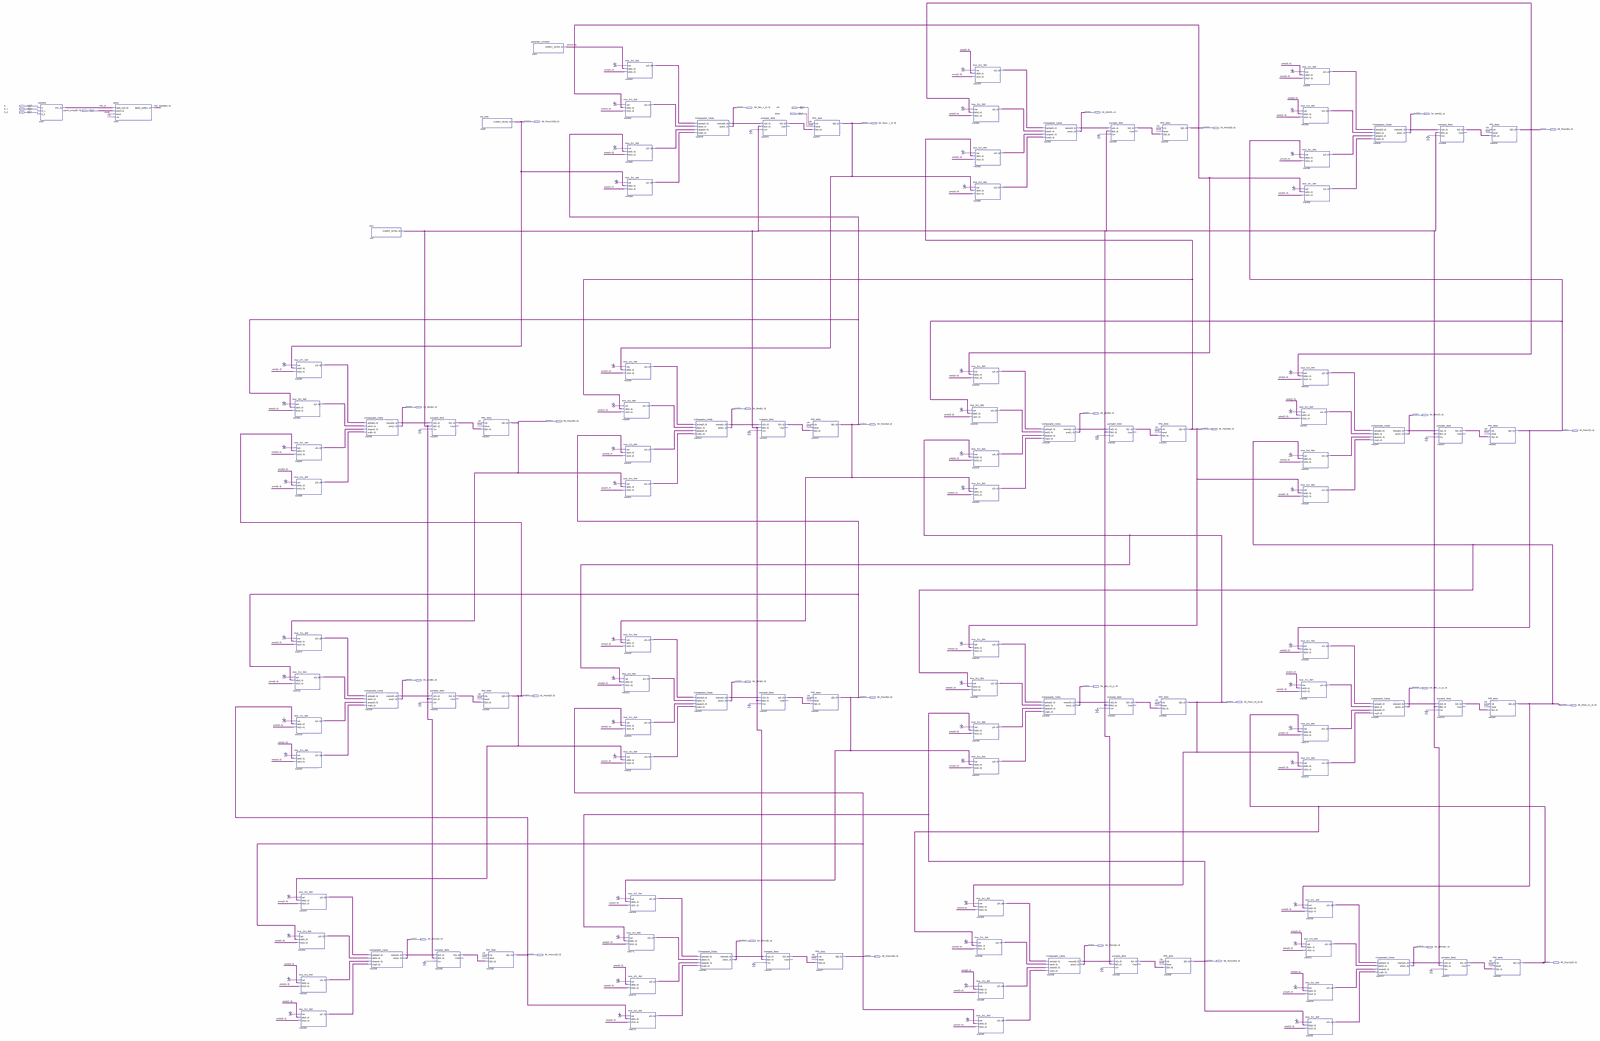
[diagram p0: schematic sheet, whole]
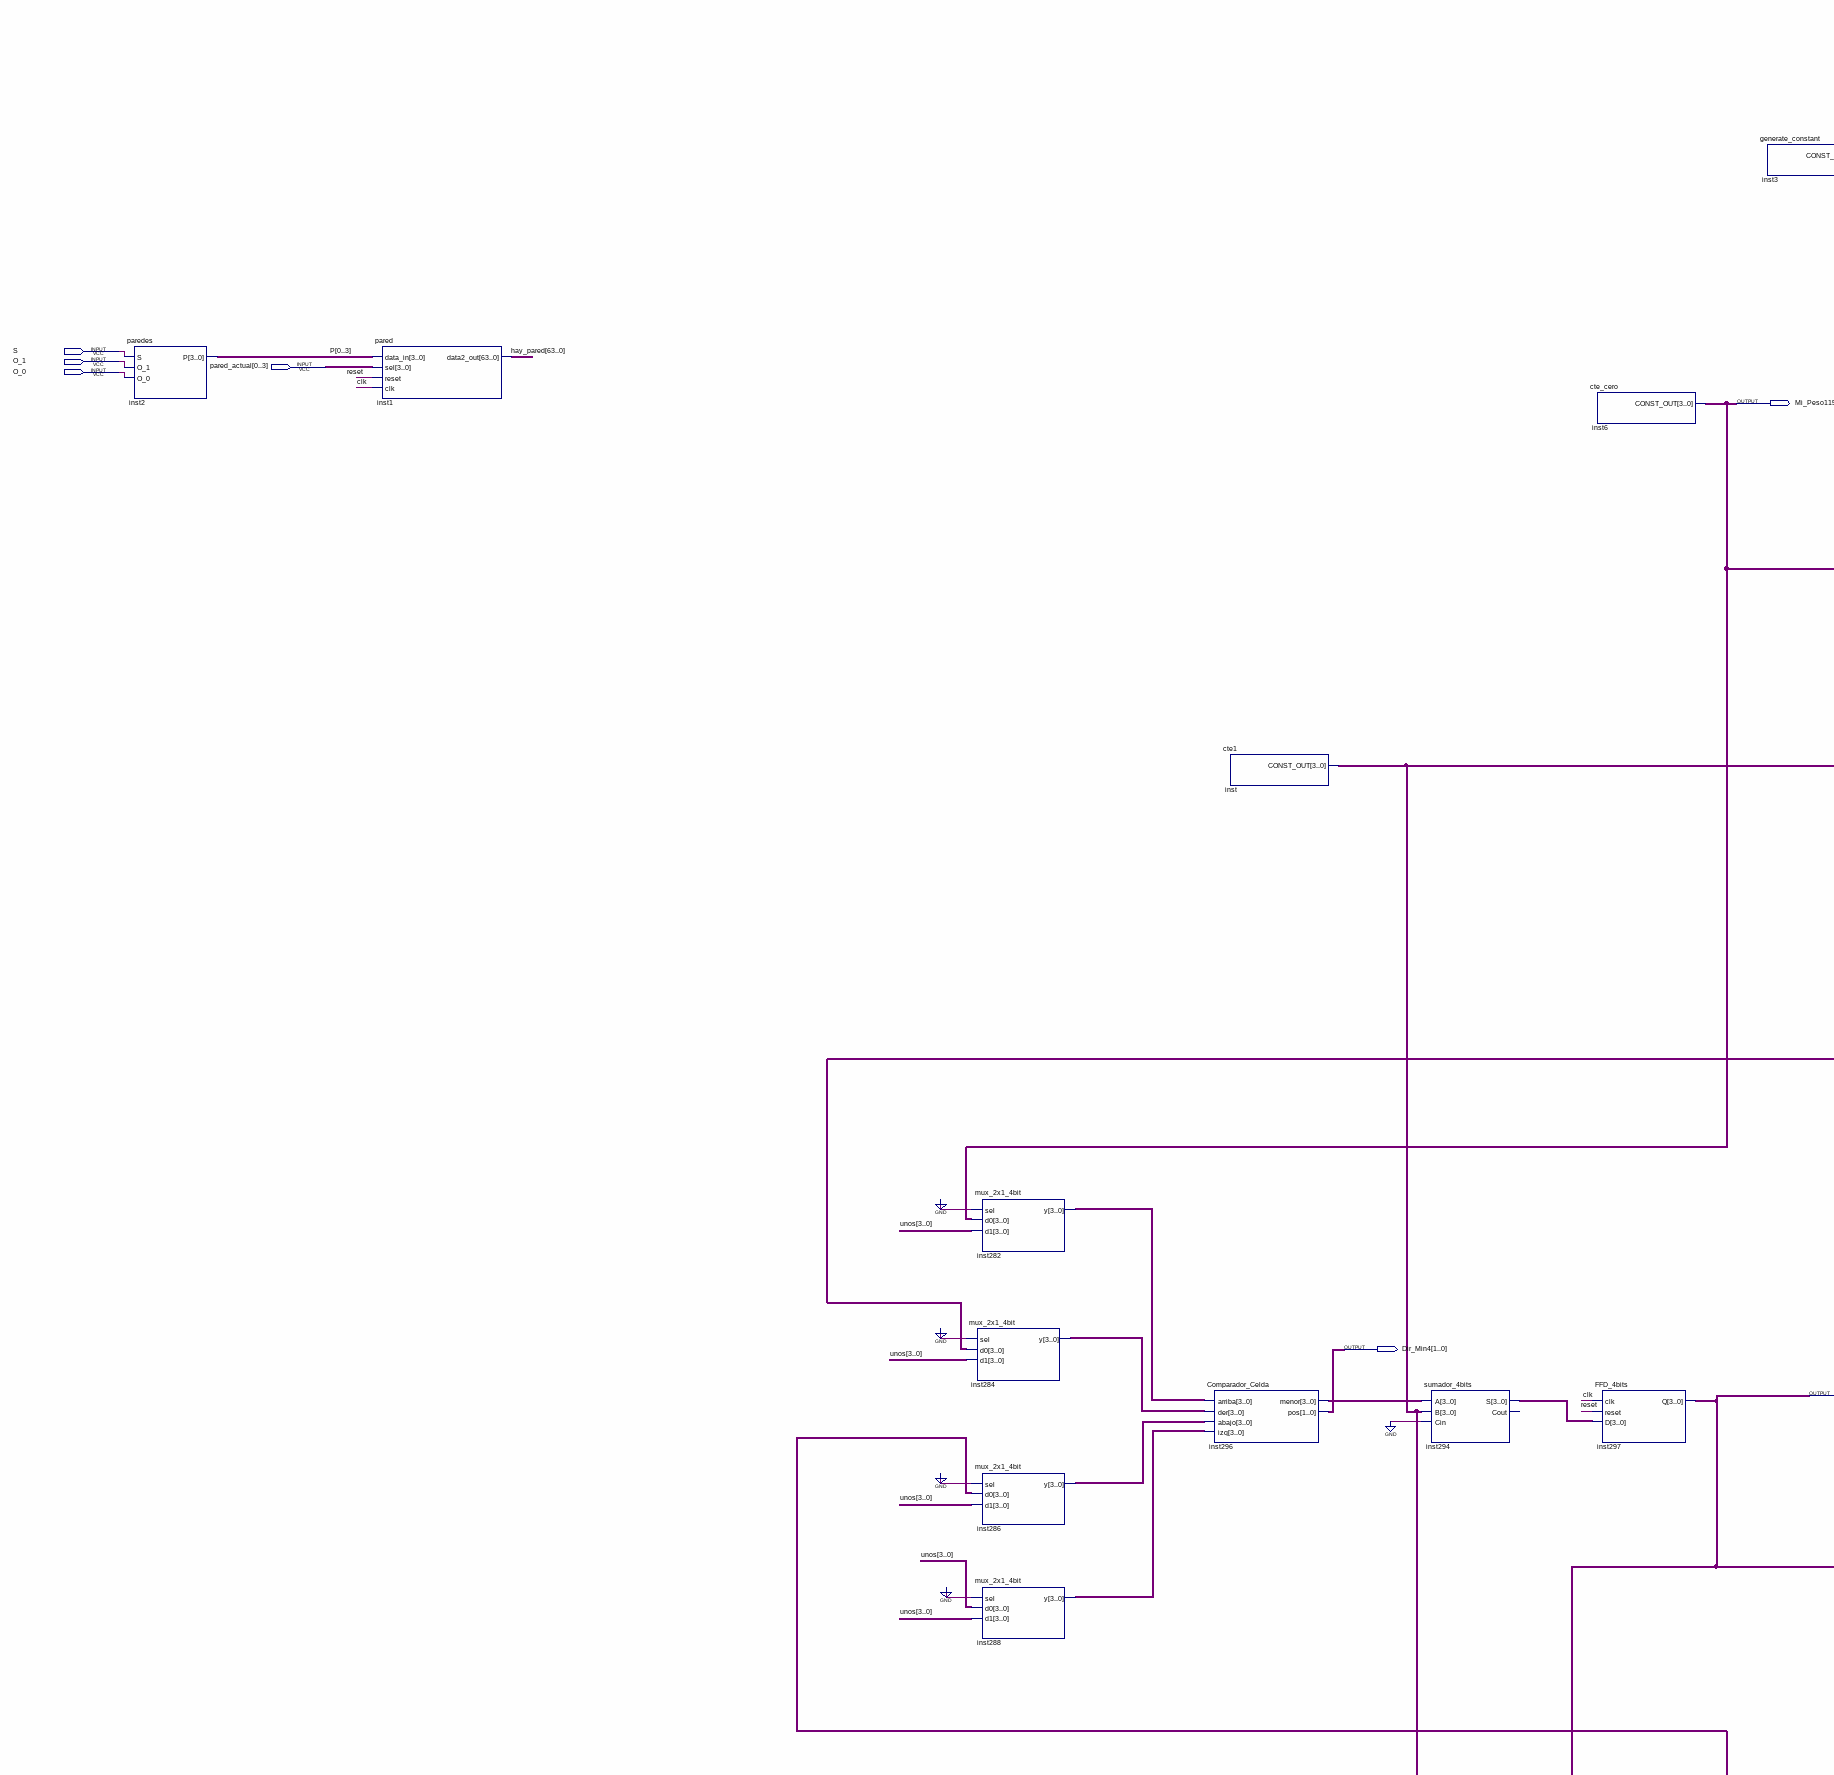
[diagram p1: schematic sheet, upper left part]
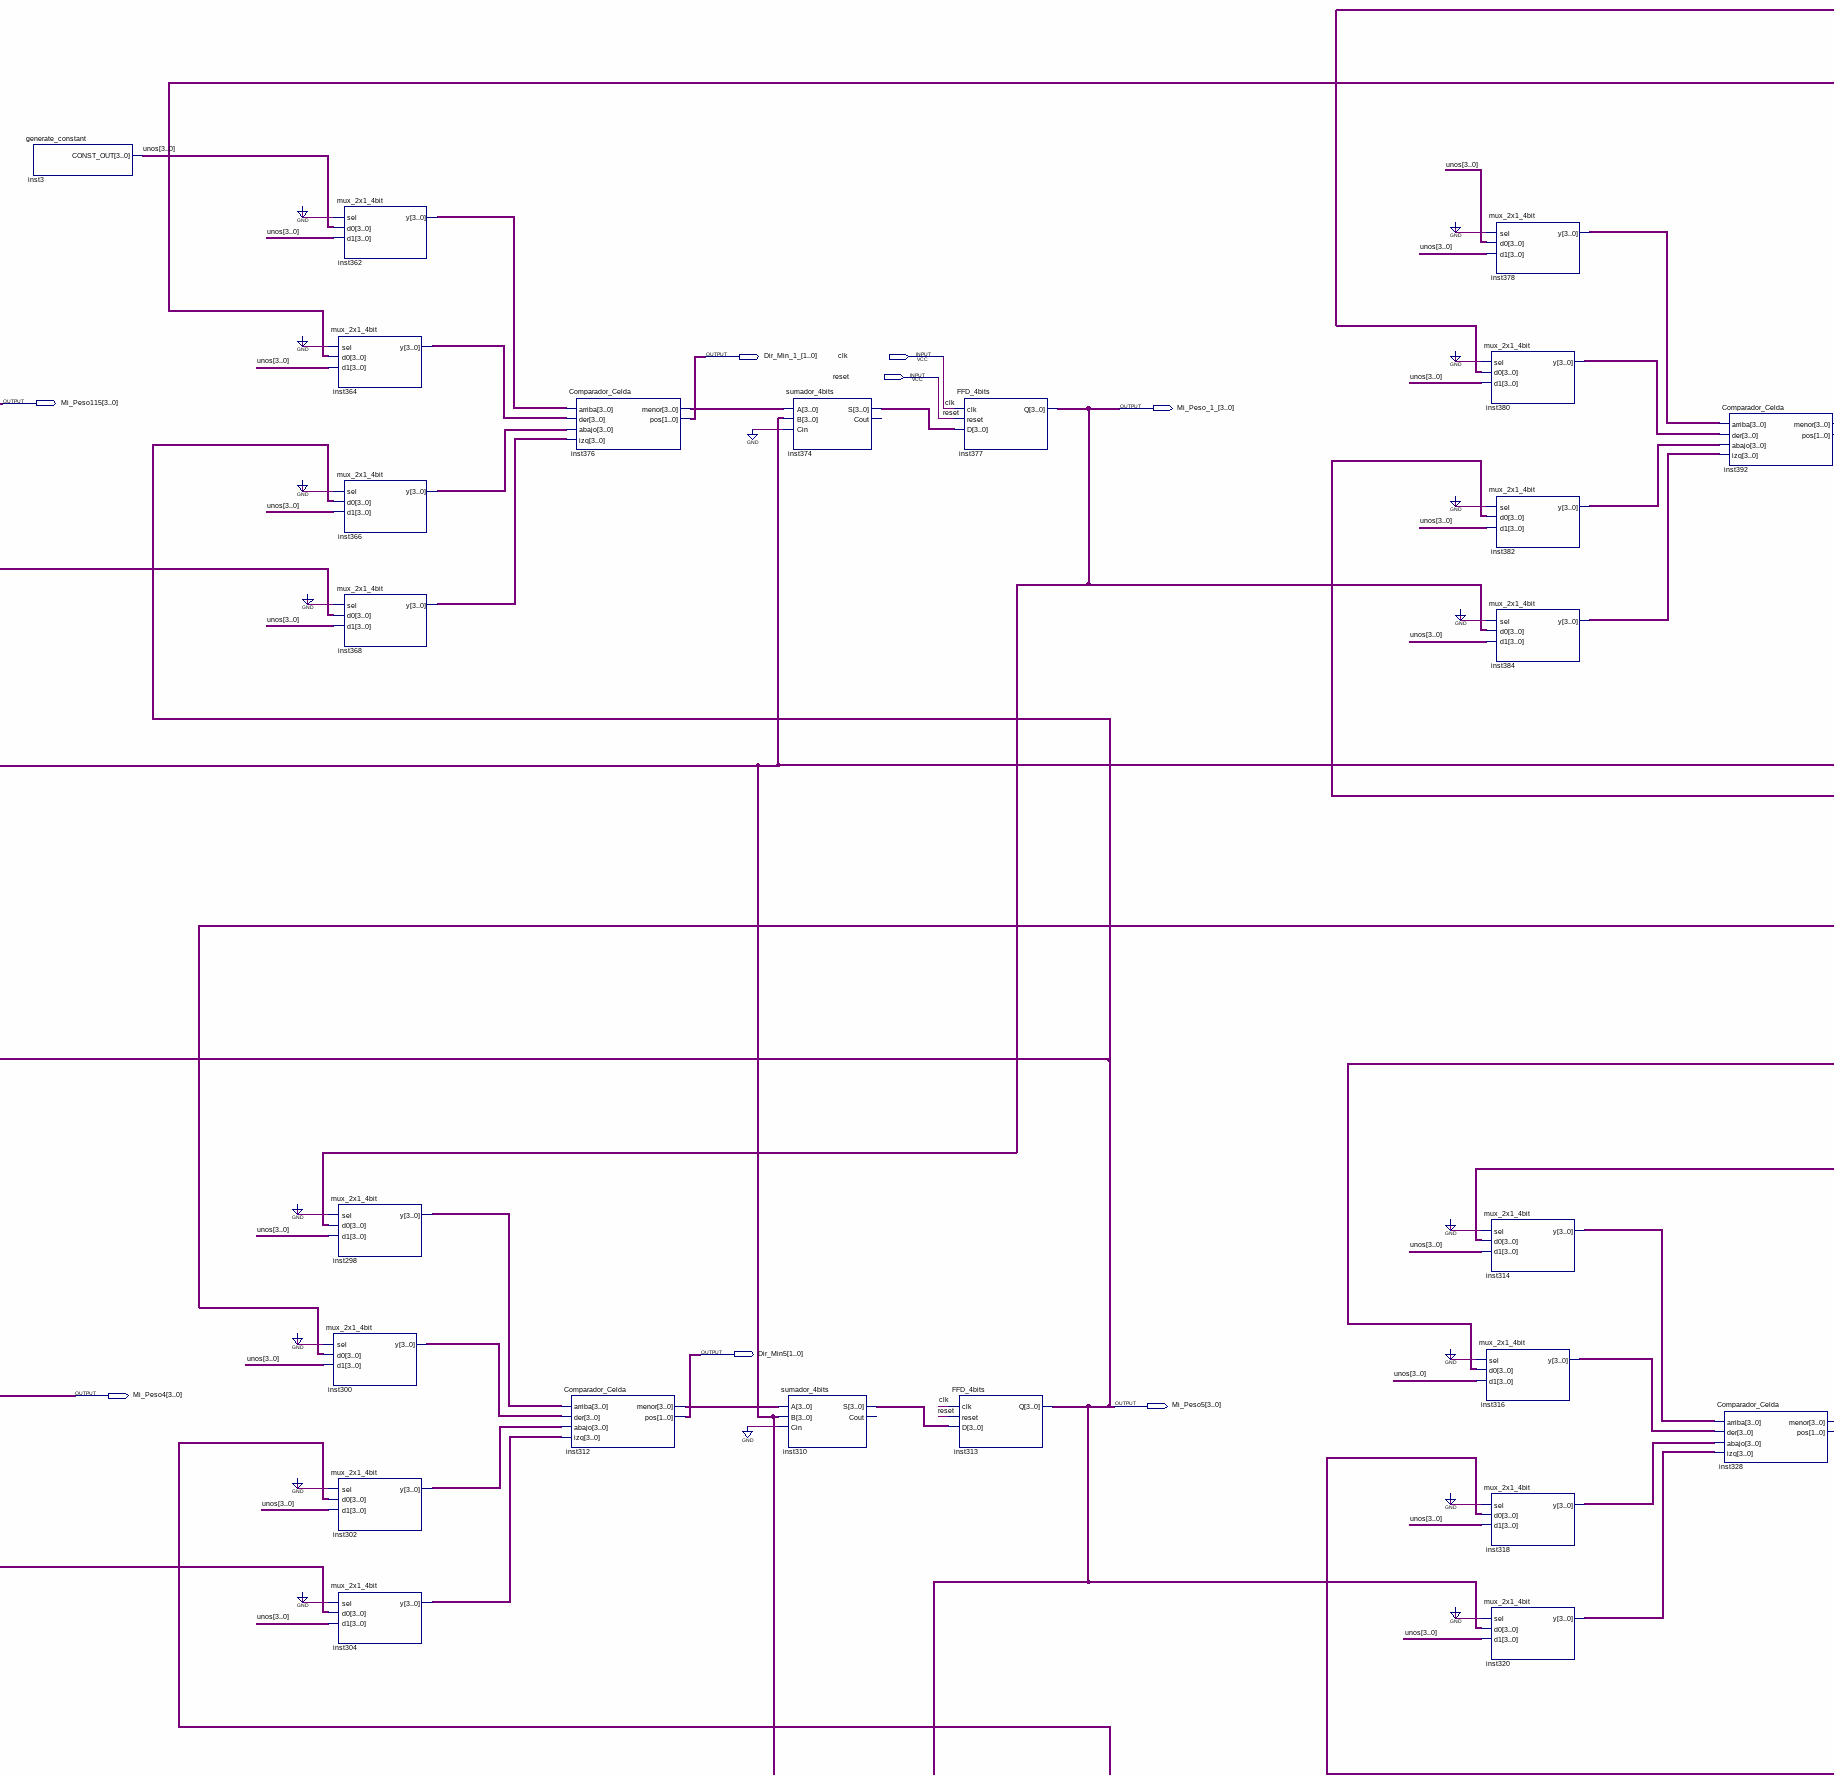
[diagram p2: schematic sheet, upper centre part]
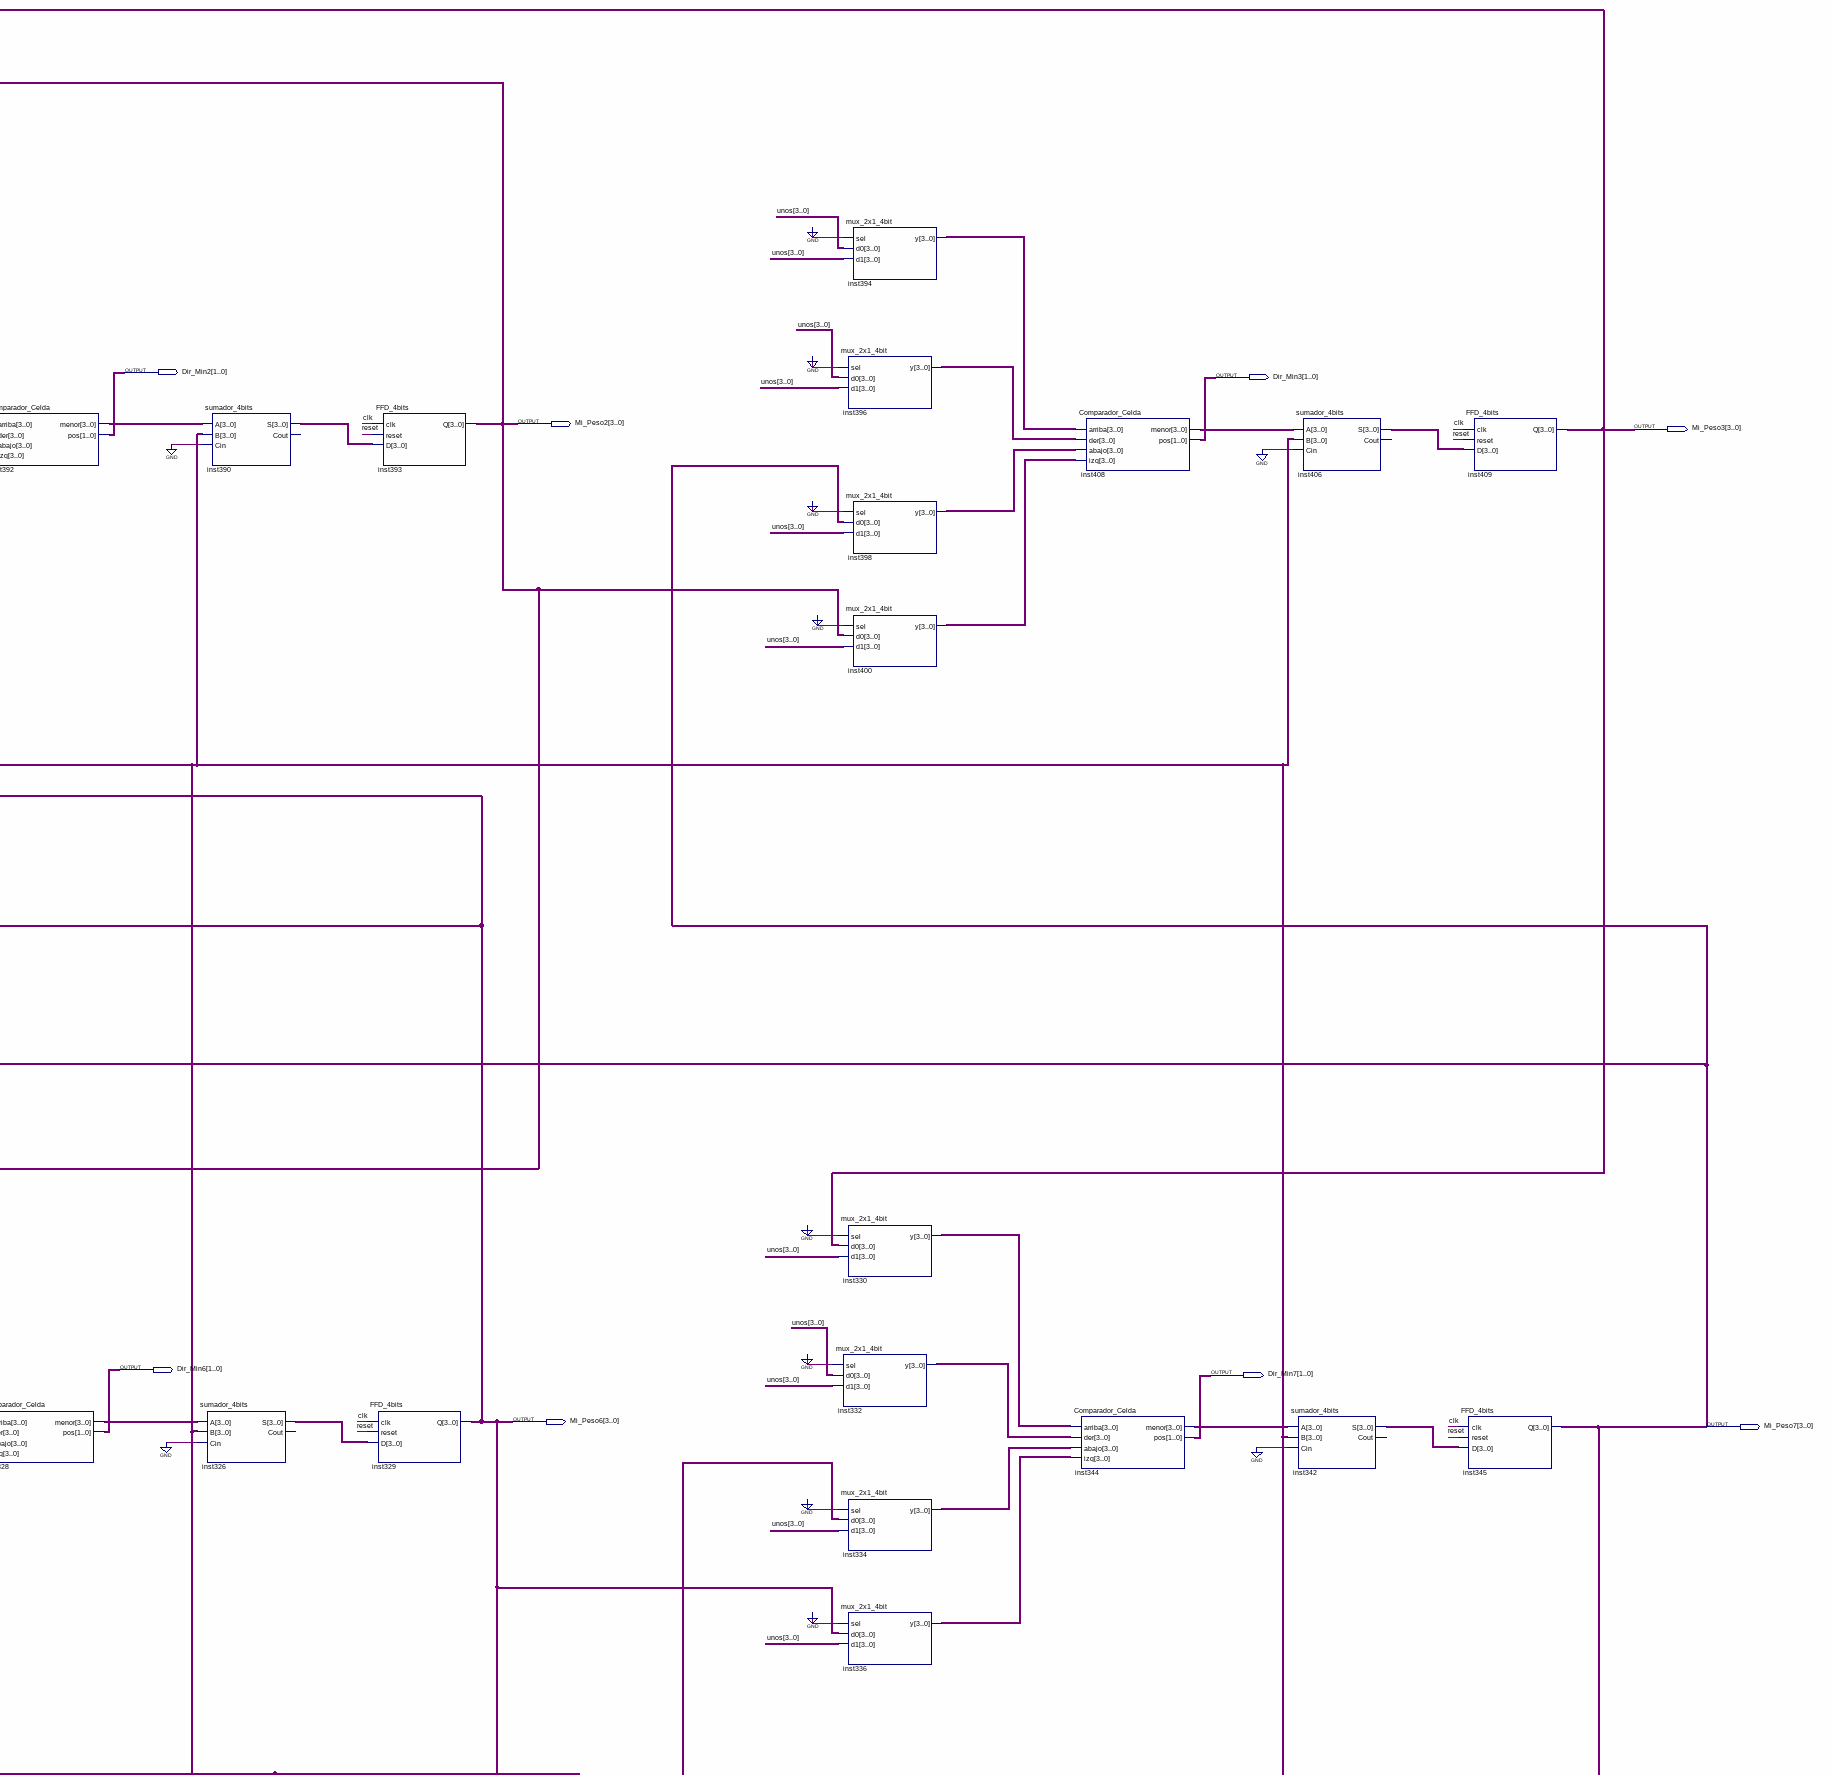
[diagram p3: schematic sheet, upper right part]
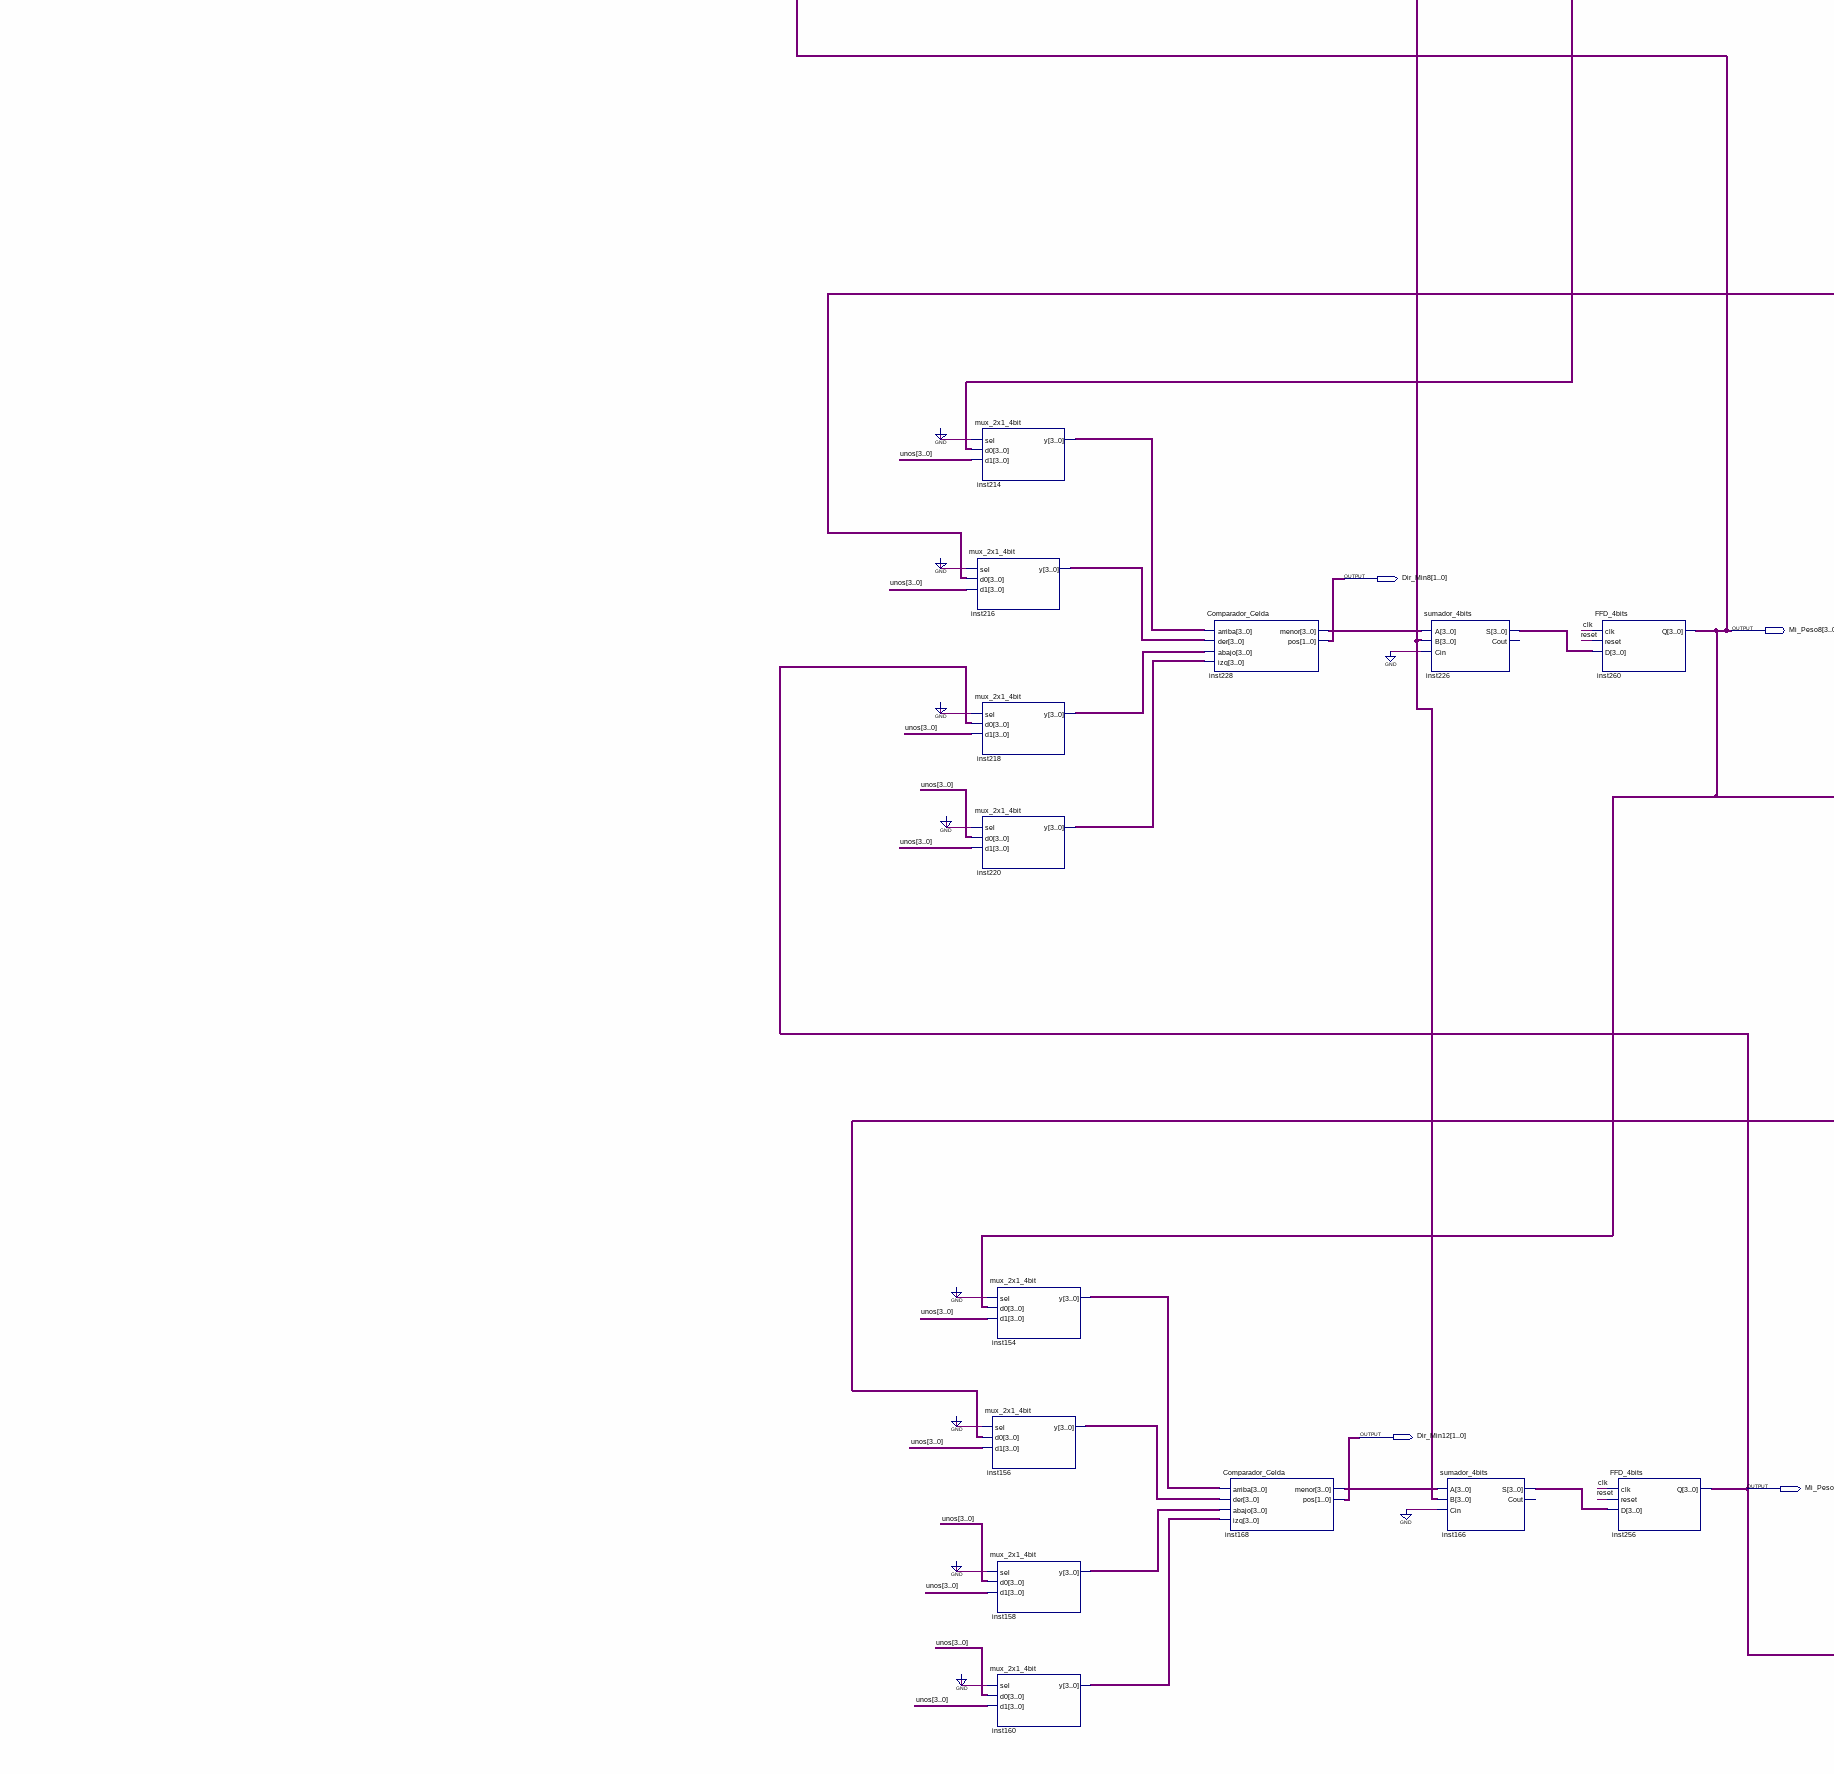
[diagram p4: schematic sheet, lower left part]
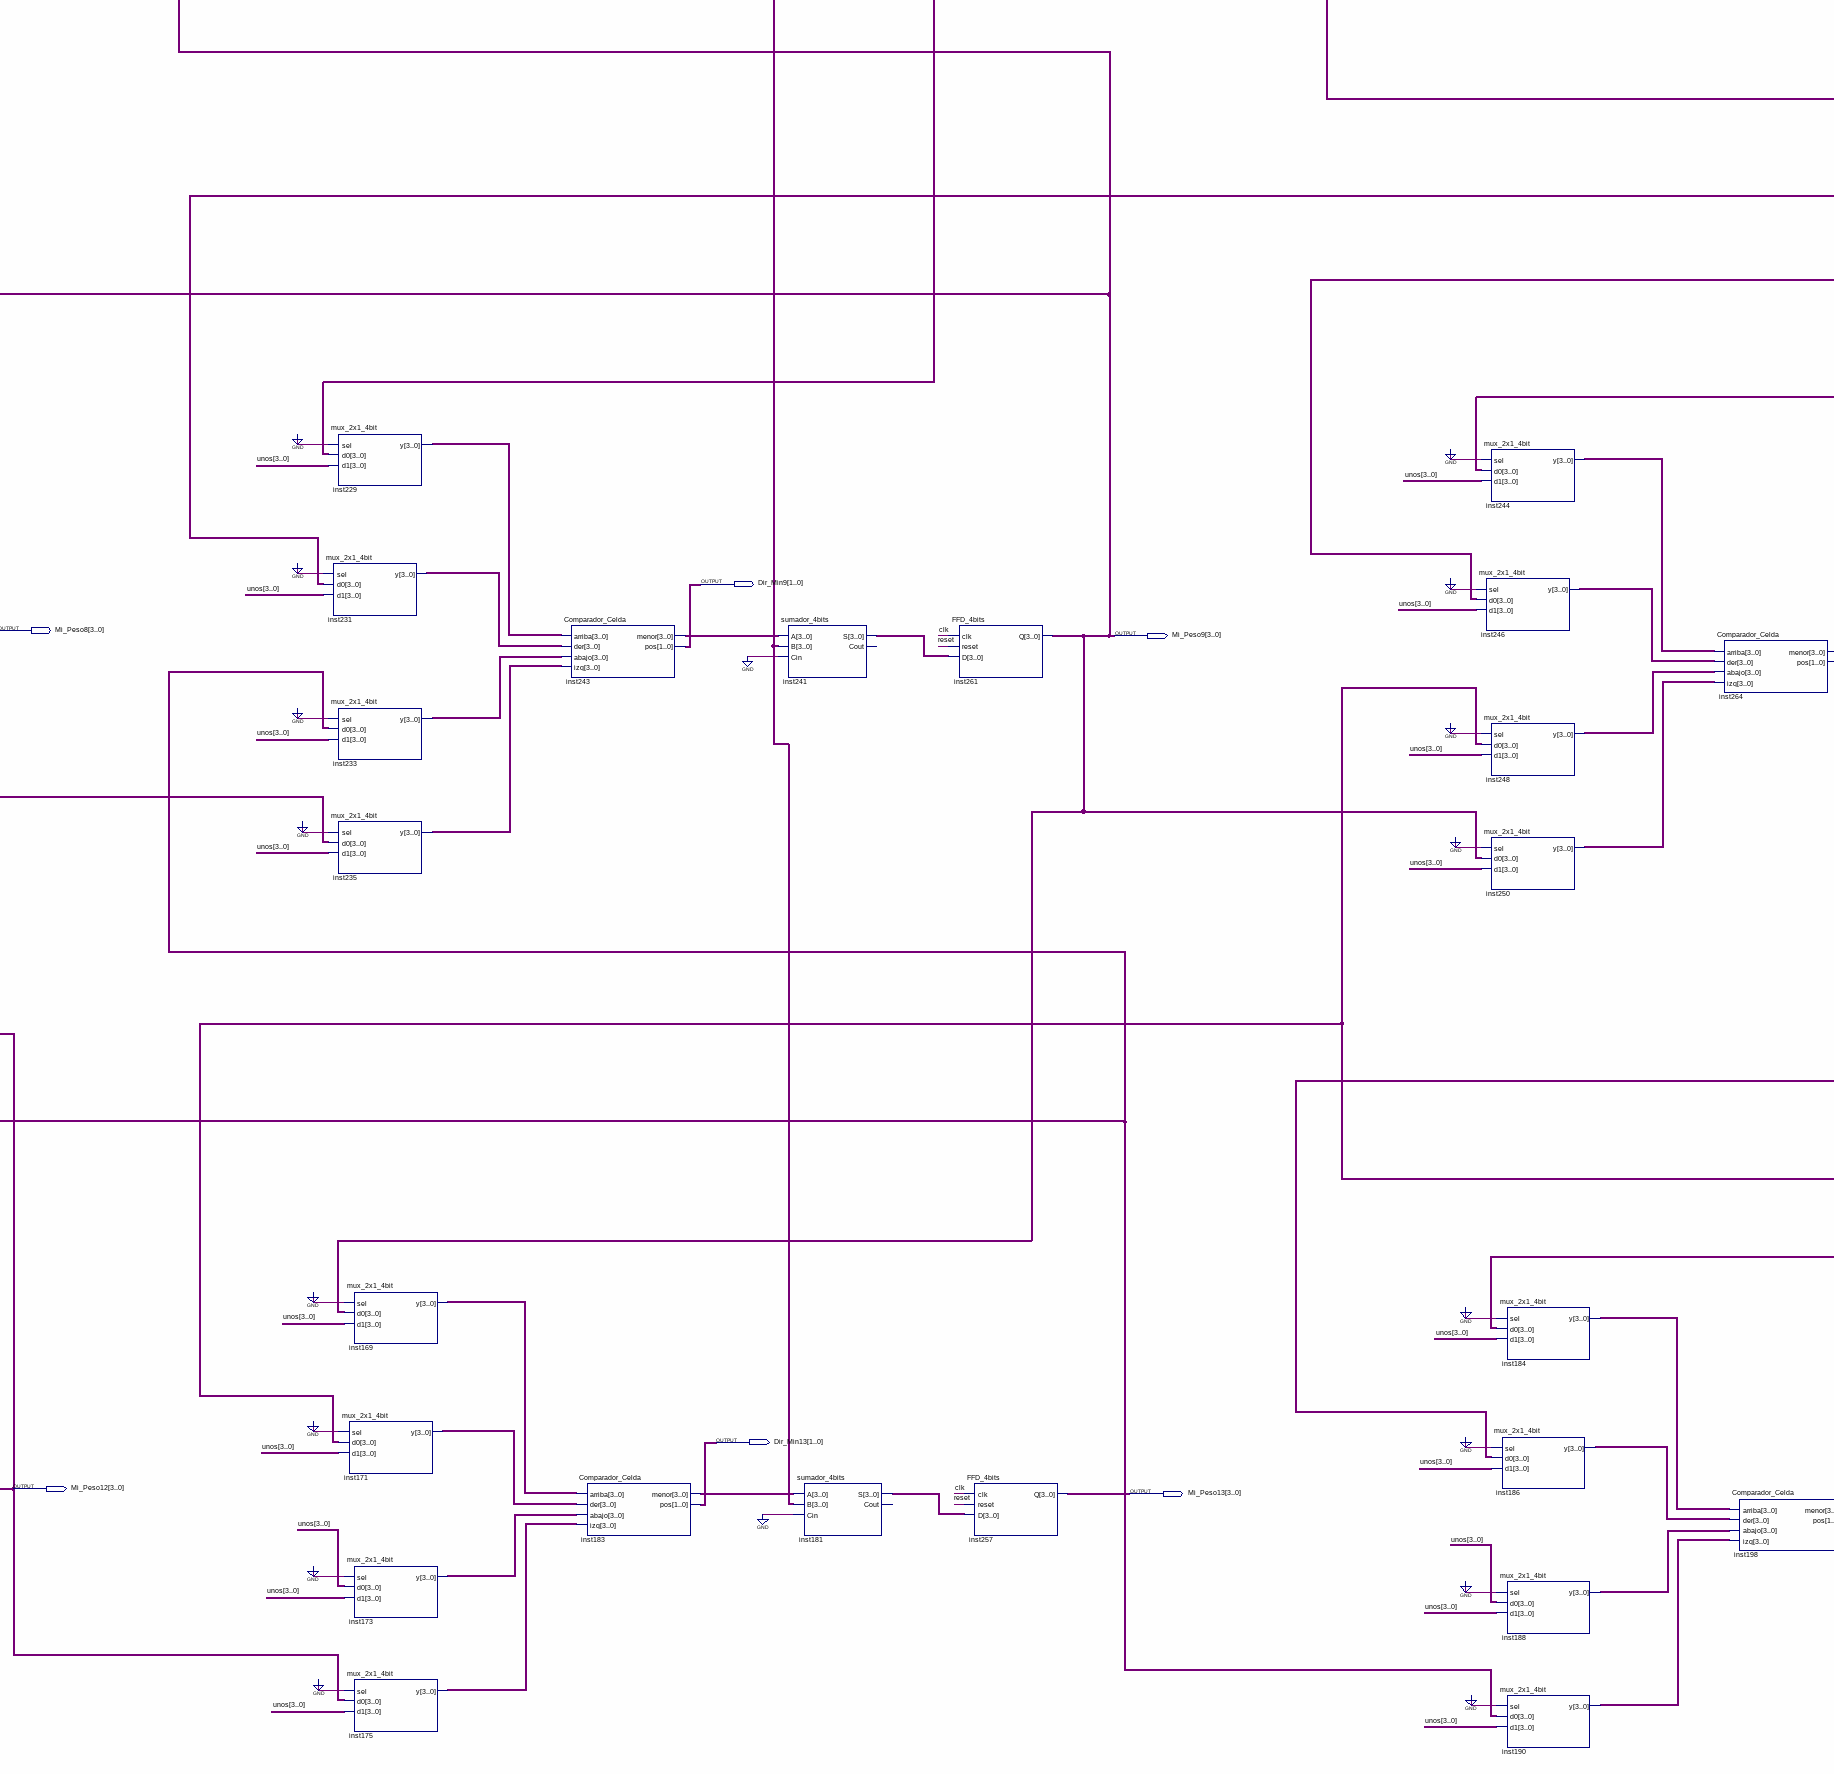
[diagram p5: schematic sheet, lower centre part]
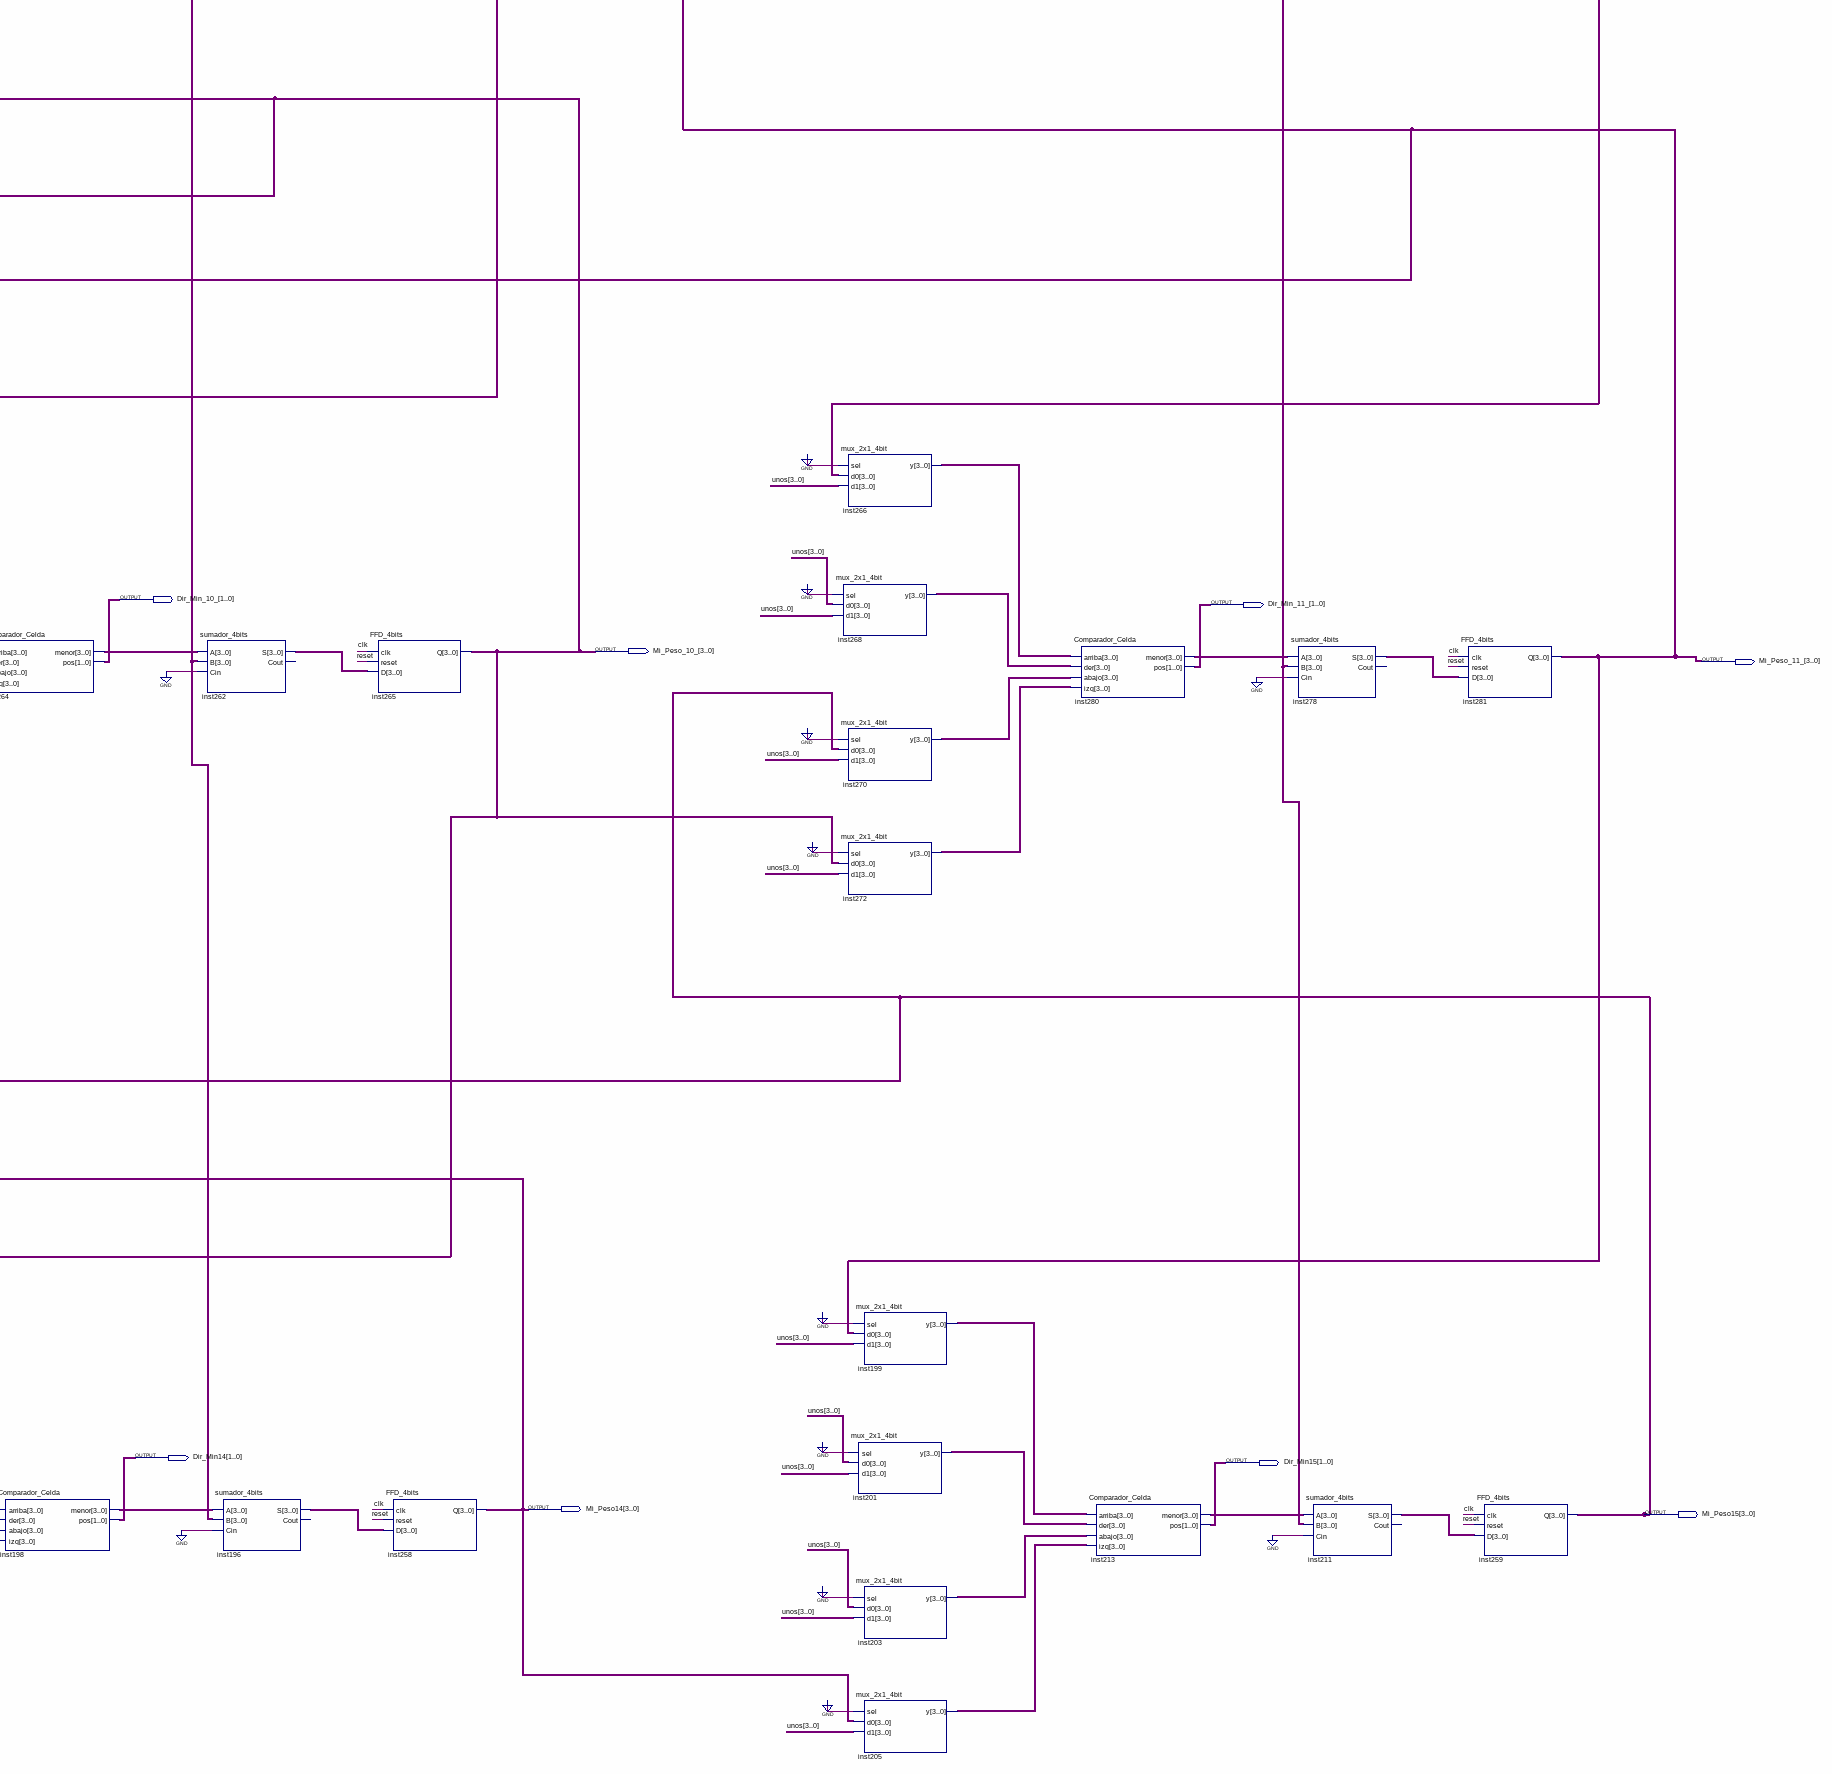
[diagram p6: schematic sheet, lower right part]
// Quartus schematic floodfill_para_simular.bdf as structural Verilog: 110 symbols, 37 pins
module floodfill_para_simular (
  input  S,
  input  clk,
  input  O_1,
  input  [0:3] pared_actual,
  input  O_0,
  input  reset,
  output [1:0] Dir_Min_1_,
  output [1:0] Dir_Min2,
  output [1:0] Dir_Min3,
  output [3:0] Mi_Peso115,
  output [3:0] Mi_Peso_1_,
  output [3:0] Mi_Peso2,
  output [3:0] Mi_Peso3,
  output [1:0] Dir_Min4,
  output [1:0] Dir_Min5,
  output [1:0] Dir_Min6,
  output [1:0] Dir_Min7,
  output [3:0] Mi_Peso4,
  output [3:0] Mi_Peso5,
  output [3:0] Mi_Peso6,
  output [3:0] Mi_Peso7,
  output [1:0] Dir_Min8,
  output [1:0] Dir_Min9,
  output [1:0] Dir_Min_10_,
  output [1:0] Dir_Min_11_,
  output [3:0] Mi_Peso8,
  output [3:0] Mi_Peso9,
  output [3:0] Mi_Peso_10_,
  output [3:0] Mi_Peso_11_,
  output [1:0] Dir_Min12,
  output [1:0] Dir_Min13,
  output [1:0] Dir_Min14,
  output [1:0] Dir_Min15,
  output [3:0] Mi_Peso12,
  output [3:0] Mi_Peso13,
  output [3:0] Mi_Peso14,
  output [3:0] Mi_Peso15
);

  wire [3:0] inst154_y, inst156_y, inst158_y, inst160_y, inst166_s, inst168_menor, inst169_y, inst171_y,
       inst173_y, inst175_y, inst181_s, inst183_menor, inst184_y, inst186_y, inst188_y, inst190_y, inst196_s,
       inst198_menor, inst199_y, inst201_y, inst203_y, inst205_y, inst211_s, inst213_menor, inst214_y,
       inst216_y, inst218_y, inst220_y, inst226_s, inst228_menor, inst229_y, inst231_y, inst233_y, inst235_y,
       inst241_s, inst243_menor, inst244_y, inst246_y, inst248_y, inst250_y, inst262_s, inst264_menor,
       inst266_y, inst268_y, inst270_y, inst272_y, inst278_s, inst280_menor, inst282_y, inst284_y, inst286_y,
       inst288_y, inst294_s, inst296_menor, inst298_y, inst300_y, inst302_y, inst304_y, inst310_s,
       inst312_menor, inst314_y, inst316_y, inst318_y, inst320_y, inst326_s, inst328_menor, inst330_y,
       inst332_y, inst334_y, inst336_y, inst342_s, inst344_menor, inst362_y, inst364_y, inst366_y, inst368_y,
       inst374_s, inst376_menor, inst378_y, inst380_y, inst382_y, inst384_y, inst390_s, inst392_menor,
       inst394_y, inst396_y, inst398_y, inst400_y, inst406_s, inst408_menor, inst_const_out, P, unos;
  wire [63:0] hay_pared;

  paredes inst2 (.S(S), .O_1(O_1), .O_0(O_0), .P({P[0], P[1], P[2], P[3]}));
  pared inst1 (.data_in({P[0], P[1], P[2], P[3]}), .sel(pared_actual), .reset(reset), .clk(clk), .data2_out(hay_pared));
  mux_2x1_4bit inst282 (.sel(1'b0), .d0(Mi_Peso115), .d1(unos), .y(inst282_y));
  mux_2x1_4bit inst284 (.sel(1'b0), .d0(Mi_Peso5), .d1(unos), .y(inst284_y));
  mux_2x1_4bit inst286 (.sel(1'b0), .d0(Mi_Peso8), .d1(unos), .y(inst286_y));
  mux_2x1_4bit inst288 (.sel(1'b0), .d0(unos), .d1(unos), .y(inst288_y));
  mux_2x1_4bit inst214 (.sel(1'b0), .d0(Mi_Peso4), .d1(unos), .y(inst214_y));
  mux_2x1_4bit inst216 (.sel(1'b0), .d0(Mi_Peso9), .d1(unos), .y(inst216_y));
  mux_2x1_4bit inst218 (.sel(1'b0), .d0(Mi_Peso12), .d1(unos), .y(inst218_y));
  mux_2x1_4bit inst220 (.sel(1'b0), .d0(unos), .d1(unos), .y(inst220_y));
  mux_2x1_4bit inst154 (.sel(1'b0), .d0(Mi_Peso8), .d1(unos), .y(inst154_y));
  mux_2x1_4bit inst156 (.sel(1'b0), .d0(Mi_Peso13), .d1(unos), .y(inst156_y));
  mux_2x1_4bit inst158 (.sel(1'b0), .d0(unos), .d1(unos), .y(inst158_y));
  mux_2x1_4bit inst160 (.sel(1'b0), .d0(unos), .d1(unos), .y(inst160_y));
  cte1 inst (.CONST_OUT(inst_const_out));
  Comparador_Celda inst296 (
    .arriba(inst282_y), .der(inst284_y), .abajo(inst286_y), .izq(inst288_y), .menor(inst296_menor),
    .pos(Dir_Min4));
  Comparador_Celda inst228 (
    .arriba(inst214_y), .der(inst216_y), .abajo(inst218_y), .izq(inst220_y), .menor(inst228_menor),
    .pos(Dir_Min8));
  Comparador_Celda inst168 (
    .arriba(inst154_y), .der(inst156_y), .abajo(inst158_y), .izq(inst160_y), .menor(inst168_menor),
    .pos(Dir_Min12));
  sumador_4bits inst294 (.A(inst296_menor), .B(inst_const_out), .Cin(1'b0), .S(inst294_s));  // open: Cout
  sumador_4bits inst226 (.A(inst228_menor), .B(inst_const_out), .Cin(1'b0), .S(inst226_s));  // open: Cout
  sumador_4bits inst166 (.A(inst168_menor), .B(inst_const_out), .Cin(1'b0), .S(inst166_s));  // open: Cout
  cte_cero inst6 (.CONST_OUT(Mi_Peso115));
  FFD_4bits inst297 (.clk(clk), .reset(reset), .D(inst294_s), .Q(Mi_Peso4));
  FFD_4bits inst260 (.clk(clk), .reset(reset), .D(inst226_s), .Q(Mi_Peso8));
  FFD_4bits inst256 (.clk(clk), .reset(reset), .D(inst166_s), .Q(Mi_Peso12));
  generate_constant inst3 (.CONST_OUT(unos));
  mux_2x1_4bit inst362 (.sel(1'b0), .d0(unos), .d1(unos), .y(inst362_y));
  mux_2x1_4bit inst364 (.sel(1'b0), .d0(Mi_Peso2), .d1(unos), .y(inst364_y));
  mux_2x1_4bit inst366 (.sel(1'b0), .d0(Mi_Peso5), .d1(unos), .y(inst366_y));
  mux_2x1_4bit inst368 (.sel(1'b0), .d0(Mi_Peso115), .d1(unos), .y(inst368_y));
  mux_2x1_4bit inst298 (.sel(1'b0), .d0(Mi_Peso_1_), .d1(unos), .y(inst298_y));
  mux_2x1_4bit inst300 (.sel(1'b0), .d0(Mi_Peso6), .d1(unos), .y(inst300_y));
  mux_2x1_4bit inst302 (.sel(1'b0), .d0(Mi_Peso9), .d1(unos), .y(inst302_y));
  mux_2x1_4bit inst304 (.sel(1'b0), .d0(Mi_Peso4), .d1(unos), .y(inst304_y));
  mux_2x1_4bit inst229 (.sel(1'b0), .d0(Mi_Peso5), .d1(unos), .y(inst229_y));
  mux_2x1_4bit inst231 (.sel(1'b0), .d0(Mi_Peso_10_), .d1(unos), .y(inst231_y));
  mux_2x1_4bit inst233 (.sel(1'b0), .d0(Mi_Peso13), .d1(unos), .y(inst233_y));
  mux_2x1_4bit inst235 (.sel(1'b0), .d0(Mi_Peso8), .d1(unos), .y(inst235_y));
  mux_2x1_4bit inst169 (.sel(1'b0), .d0(Mi_Peso9), .d1(unos), .y(inst169_y));
  mux_2x1_4bit inst171 (.sel(1'b0), .d0(Mi_Peso14), .d1(unos), .y(inst171_y));
  mux_2x1_4bit inst173 (.sel(1'b0), .d0(unos), .d1(unos), .y(inst173_y));
  mux_2x1_4bit inst175 (.sel(1'b0), .d0(Mi_Peso12), .d1(unos), .y(inst175_y));
  Comparador_Celda inst376 (
    .arriba(inst362_y), .der(inst364_y), .abajo(inst366_y), .izq(inst368_y), .menor(inst376_menor),
    .pos(Dir_Min_1_));
  Comparador_Celda inst312 (
    .arriba(inst298_y), .der(inst300_y), .abajo(inst302_y), .izq(inst304_y), .menor(inst312_menor),
    .pos(Dir_Min5));
  Comparador_Celda inst243 (
    .arriba(inst229_y), .der(inst231_y), .abajo(inst233_y), .izq(inst235_y), .menor(inst243_menor),
    .pos(Dir_Min9));
  Comparador_Celda inst183 (
    .arriba(inst169_y), .der(inst171_y), .abajo(inst173_y), .izq(inst175_y), .menor(inst183_menor),
    .pos(Dir_Min13));
  sumador_4bits inst374 (.A(inst376_menor), .B(inst_const_out), .Cin(1'b0), .S(inst374_s));  // open: Cout
  sumador_4bits inst310 (.A(inst312_menor), .B(inst_const_out), .Cin(1'b0), .S(inst310_s));  // open: Cout
  sumador_4bits inst241 (.A(inst243_menor), .B(inst_const_out), .Cin(1'b0), .S(inst241_s));  // open: Cout
  sumador_4bits inst181 (.A(inst183_menor), .B(inst_const_out), .Cin(1'b0), .S(inst181_s));  // open: Cout
  FFD_4bits inst377 (.clk(clk), .reset(reset), .D(inst374_s), .Q(Mi_Peso_1_));
  FFD_4bits inst313 (.clk(clk), .reset(reset), .D(inst310_s), .Q(Mi_Peso5));
  FFD_4bits inst261 (.clk(clk), .reset(reset), .D(inst241_s), .Q(Mi_Peso9));
  FFD_4bits inst257 (.clk(clk), .reset(reset), .D(inst181_s), .Q(Mi_Peso13));
  mux_2x1_4bit inst378 (.sel(1'b0), .d0(unos), .d1(unos), .y(inst378_y));
  mux_2x1_4bit inst380 (.sel(1'b0), .d0(Mi_Peso3), .d1(unos), .y(inst380_y));
  mux_2x1_4bit inst382 (.sel(1'b0), .d0(Mi_Peso6), .d1(unos), .y(inst382_y));
  mux_2x1_4bit inst384 (.sel(1'b0), .d0(Mi_Peso_1_), .d1(unos), .y(inst384_y));
  mux_2x1_4bit inst314 (.sel(1'b0), .d0(Mi_Peso2), .d1(unos), .y(inst314_y));
  mux_2x1_4bit inst316 (.sel(1'b0), .d0(Mi_Peso7), .d1(unos), .y(inst316_y));
  mux_2x1_4bit inst318 (.sel(1'b0), .d0(Mi_Peso_10_), .d1(unos), .y(inst318_y));
  mux_2x1_4bit inst320 (.sel(1'b0), .d0(Mi_Peso5), .d1(unos), .y(inst320_y));
  mux_2x1_4bit inst244 (.sel(1'b0), .d0(Mi_Peso6), .d1(unos), .y(inst244_y));
  mux_2x1_4bit inst246 (.sel(1'b0), .d0(Mi_Peso_11_), .d1(unos), .y(inst246_y));
  mux_2x1_4bit inst248 (.sel(1'b0), .d0(Mi_Peso14), .d1(unos), .y(inst248_y));
  mux_2x1_4bit inst250 (.sel(1'b0), .d0(Mi_Peso9), .d1(unos), .y(inst250_y));
  mux_2x1_4bit inst186 (.sel(1'b0), .d0(Mi_Peso15), .d1(unos), .y(inst186_y));
  mux_2x1_4bit inst184 (.sel(1'b0), .d0(Mi_Peso_10_), .d1(unos), .y(inst184_y));
  mux_2x1_4bit inst188 (.sel(1'b0), .d0(unos), .d1(unos), .y(inst188_y));
  mux_2x1_4bit inst190 (.sel(1'b0), .d0(Mi_Peso13), .d1(unos), .y(inst190_y));
  Comparador_Celda inst392 (
    .arriba(inst378_y), .der(inst380_y), .abajo(inst382_y), .izq(inst384_y), .menor(inst392_menor),
    .pos(Dir_Min2));
  Comparador_Celda inst328 (
    .arriba(inst314_y), .der(inst316_y), .abajo(inst318_y), .izq(inst320_y), .menor(inst328_menor),
    .pos(Dir_Min6));
  Comparador_Celda inst264 (
    .arriba(inst244_y), .der(inst246_y), .abajo(inst248_y), .izq(inst250_y), .menor(inst264_menor),
    .pos(Dir_Min_10_));
  Comparador_Celda inst198 (
    .arriba(inst184_y), .der(inst186_y), .abajo(inst188_y), .izq(inst190_y), .menor(inst198_menor),
    .pos(Dir_Min14));
  sumador_4bits inst390 (.A(inst392_menor), .B(inst_const_out), .Cin(1'b0), .S(inst390_s));  // open: Cout
  sumador_4bits inst326 (.A(inst328_menor), .B(inst_const_out), .Cin(1'b0), .S(inst326_s));  // open: Cout
  sumador_4bits inst262 (.A(inst264_menor), .B(inst_const_out), .Cin(1'b0), .S(inst262_s));  // open: Cout
  sumador_4bits inst196 (.A(inst198_menor), .B(inst_const_out), .Cin(1'b0), .S(inst196_s));  // open: Cout
  FFD_4bits inst393 (.clk(clk), .reset(reset), .D(inst390_s), .Q(Mi_Peso2));
  FFD_4bits inst329 (.clk(clk), .reset(reset), .D(inst326_s), .Q(Mi_Peso6));
  FFD_4bits inst265 (.clk(clk), .reset(reset), .D(inst262_s), .Q(Mi_Peso_10_));
  FFD_4bits inst258 (.clk(clk), .reset(reset), .D(inst196_s), .Q(Mi_Peso14));
  mux_2x1_4bit inst332 (.sel(1'b0), .d0(unos), .d1(unos), .y(inst332_y));
  mux_2x1_4bit inst268 (.sel(1'b0), .d0(unos), .d1(unos), .y(inst268_y));
  mux_2x1_4bit inst394 (.sel(1'b0), .d0(unos), .d1(unos), .y(inst394_y));
  mux_2x1_4bit inst396 (.sel(1'b0), .d0(unos), .d1(unos), .y(inst396_y));
  mux_2x1_4bit inst398 (.sel(1'b0), .d0(Mi_Peso7), .d1(unos), .y(inst398_y));
  mux_2x1_4bit inst400 (.sel(1'b0), .d0(Mi_Peso2), .d1(unos), .y(inst400_y));
  mux_2x1_4bit inst330 (.sel(1'b0), .d0(Mi_Peso3), .d1(unos), .y(inst330_y));
  mux_2x1_4bit inst334 (.sel(1'b0), .d0(Mi_Peso_11_), .d1(unos), .y(inst334_y));
  mux_2x1_4bit inst336 (.sel(1'b0), .d0(Mi_Peso6), .d1(unos), .y(inst336_y));
  mux_2x1_4bit inst266 (.sel(1'b0), .d0(Mi_Peso7), .d1(unos), .y(inst266_y));
  mux_2x1_4bit inst270 (.sel(1'b0), .d0(Mi_Peso15), .d1(unos), .y(inst270_y));
  mux_2x1_4bit inst272 (.sel(1'b0), .d0(Mi_Peso_10_), .d1(unos), .y(inst272_y));
  mux_2x1_4bit inst199 (.sel(1'b0), .d0(Mi_Peso_11_), .d1(unos), .y(inst199_y));
  mux_2x1_4bit inst201 (.sel(1'b0), .d0(unos), .d1(unos), .y(inst201_y));
  mux_2x1_4bit inst203 (.sel(1'b0), .d0(unos), .d1(unos), .y(inst203_y));
  mux_2x1_4bit inst205 (.sel(1'b0), .d0(Mi_Peso14), .d1(unos), .y(inst205_y));
  Comparador_Celda inst408 (
    .arriba(inst394_y), .der(inst396_y), .abajo(inst398_y), .izq(inst400_y), .menor(inst408_menor),
    .pos(Dir_Min3));
  Comparador_Celda inst344 (
    .arriba(inst330_y), .der(inst332_y), .abajo(inst334_y), .izq(inst336_y), .menor(inst344_menor),
    .pos(Dir_Min7));
  Comparador_Celda inst280 (
    .arriba(inst266_y), .der(inst268_y), .abajo(inst270_y), .izq(inst272_y), .menor(inst280_menor),
    .pos(Dir_Min_11_));
  Comparador_Celda inst213 (
    .arriba(inst199_y), .der(inst201_y), .abajo(inst203_y), .izq(inst205_y), .menor(inst213_menor),
    .pos(Dir_Min15));
  sumador_4bits inst342 (.A(inst344_menor), .B(inst_const_out), .Cin(1'b0), .S(inst342_s));  // open: Cout
  sumador_4bits inst278 (.A(inst280_menor), .B(inst_const_out), .Cin(1'b0), .S(inst278_s));  // open: Cout
  sumador_4bits inst406 (.A(inst408_menor), .B(inst_const_out), .Cin(1'b0), .S(inst406_s));  // open: Cout
  sumador_4bits inst211 (.A(inst213_menor), .B(inst_const_out), .Cin(1'b0), .S(inst211_s));  // open: Cout
  FFD_4bits inst409 (.clk(clk), .reset(reset), .D(inst406_s), .Q(Mi_Peso3));
  FFD_4bits inst345 (.clk(clk), .reset(reset), .D(inst342_s), .Q(Mi_Peso7));
  FFD_4bits inst281 (.clk(clk), .reset(reset), .D(inst278_s), .Q(Mi_Peso_11_));
  FFD_4bits inst259 (.clk(clk), .reset(reset), .D(inst211_s), .Q(Mi_Peso15));
endmodule
